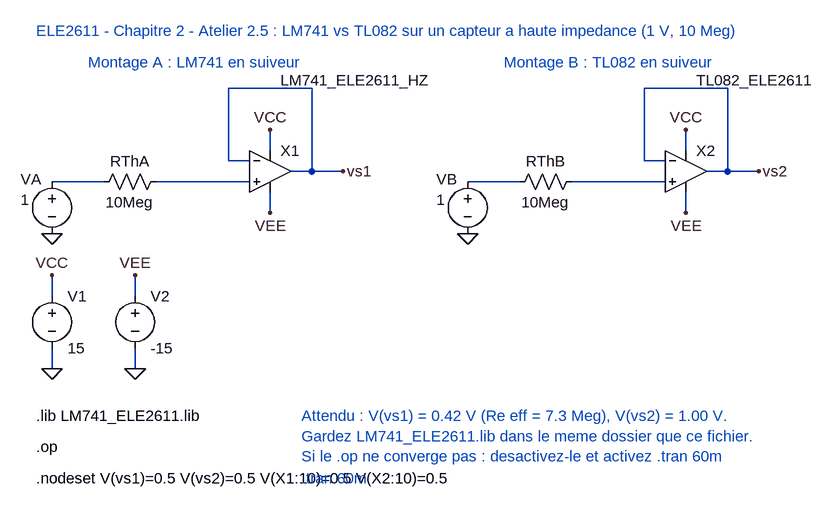
[diagram p0: schematic Ch2_Atelier_2_5_LM741_vs_TL082.asc]
Ch2_Atelier_2_5_LM741_vs_TL082.asc, the LTspice schematic file:
Version 4
SHEET 1 1400 800
WIRE 96 272 176 272
WIRE 256 272 400 272
WIRE 464 256 496 256
WIRE 496 128 496 256
WIRE 368 128 496 128
WIRE 368 128 368 240
WIRE 368 240 400 240
WIRE 496 256 544 256
WIRE 432 192 432 224
WIRE 432 288 432 320
WIRE 736 272 816 272
WIRE 896 272 1040 272
WIRE 1104 256 1136 256
WIRE 1136 128 1136 256
WIRE 1008 128 1136 128
WIRE 1008 128 1008 240
WIRE 1008 240 1040 240
WIRE 1136 256 1184 256
WIRE 1072 192 1072 224
WIRE 1072 288 1072 320
WIRE 96 416 96 448
WIRE 96 528 96 560
WIRE 224 416 224 448
WIRE 224 528 224 560
FLAG 96 352 0
FLAG 544 256 vs1
FLAG 432 192 VCC
FLAG 432 320 VEE
FLAG 736 352 0
FLAG 1184 256 vs2
FLAG 1072 192 VCC
FLAG 1072 320 VEE
FLAG 96 416 VCC
FLAG 96 560 0
FLAG 224 416 VEE
FLAG 224 560 0
SYMBOL voltage 96 256 R0
WINDOW 0 -48 12 Left 2
WINDOW 3 -48 44 Left 2
SYMATTR InstName VA
SYMATTR Value 1
SYMBOL res 272 256 R90
WINDOW 0 0 56 VBottom 2
WINDOW 3 32 56 VTop 2
SYMATTR InstName RThA
SYMATTR Value 10Meg
SYMBOL Opamps\\opamp2 432 192 R0
WINDOW 3 16 -76 Left 2
SYMATTR InstName X1
SYMATTR Value LM741_ELE2611_HZ
SYMBOL voltage 736 256 R0
WINDOW 0 -48 12 Left 2
WINDOW 3 -48 44 Left 2
SYMATTR InstName VB
SYMATTR Value 1
SYMBOL res 912 256 R90
WINDOW 0 0 56 VBottom 2
WINDOW 3 32 56 VTop 2
SYMATTR InstName RThB
SYMATTR Value 10Meg
SYMBOL Opamps\\opamp2 1072 192 R0
WINDOW 3 16 -76 Left 2
SYMATTR InstName X2
SYMATTR Value TL082_ELE2611
SYMBOL voltage 96 432 R0
SYMATTR InstName V1
SYMATTR Value 15
SYMBOL voltage 224 432 R0
SYMATTR InstName V2
SYMATTR Value -15
TEXT 72 40 Left 2 ;ELE2611 - Chapitre 2 - Atelier 2.5 : LM741 vs TL082 sur un capteur a haute impedance (1 V, 10 Meg)
TEXT 152 88 Left 2 ;Montage A : LM741 en suiveur
TEXT 792 88 Left 2 ;Montage B : TL082 en suiveur
TEXT 72 632 Left 2 !.lib LM741_ELE2611.lib
TEXT 72 680 Left 2 !.op
TEXT 72 728 Left 2 !.nodeset V(vs1)=0.5 V(vs2)=0.5 V(X1:10)=0.5 V(X2:10)=0.5
TEXT 480 632 Left 2 ;Attendu : V(vs1) = 0.42 V (Re eff = 7.3 Meg), V(vs2) = 1.00 V.\nGardez LM741_ELE2611.lib dans le meme dossier que ce fichier.\nSi le .op ne converge pas : desactivez-le et activez .tran 60m
TEXT 480 728 Left 2 ;.tran 60m

The netlist it stands for:
* Ch2_Atelier_2_5_LM741_vs_TL082.asc
VA N001 0 1
RThA N002 N001 10Meg
XX1 N002 vs1 VCC VEE vs1 LM741_ELE2611_HZ  ; pins In+ In- V+ V- OUT
VB N003 0 1
RThB N004 N003 10Meg
XX2 N004 vs2 VCC VEE vs2 TL082_ELE2611  ; pins In+ In- V+ V- OUT
V1 VCC 0 15
V2 VEE 0 -15
* ELE2611 - Chapitre 2 - Atelier 2.5 : LM741 vs TL082 sur un capteur a haute impedance (1 V, 10 Meg)
* Montage A : LM741 en suiveur
* Montage B : TL082 en suiveur
.lib LM741_ELE2611.lib
.op
.nodeset V(vs1)=0.5 V(vs2)=0.5 V(X1:10)=0.5 V(X2:10)=0.5
* Attendu : V(vs1) = 0.42 V (Re eff = 7.3 Meg), V(vs2) = 1.00 V.
* Gardez LM741_ELE2611.lib dans le meme dossier que ce fichier.
* Si le .op ne converge pas : desactivez-le et activez .tran 60m
* .tran 60m
.backanno
.end